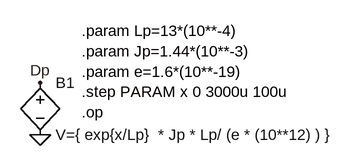
[diagram p0: schematic P1.asc]
P1.asc, the LTspice schematic file:
Version 4
SHEET 1 880 680
FLAG -368 320 0
FLAG -368 240 Dp
SYMBOL bv -368 224 R0
SYMATTR InstName B1
SYMATTR Value V={ exp{x/Lp}  * Jp * Lp/ (e * (10**12) ) }
TEXT -304 160 Left 2 !.param Lp=13*(10**-4)\n.param Jp=1.44*(10**-3)\n.param e=1.6*(10**-19)\n.step PARAM x 0 3000u 100u\n.op

The netlist it stands for:
* P1.asc
B1 Dp 0 V={ exp{x/Lp}  * Jp * Lp/ (e * (10**12) ) }
.param Lp=13*(10**-4)
.param Jp=1.44*(10**-3)
.param e=1.6*(10**-19)
.step PARAM x 0 3000u 100u
.op
.backanno
.end